# Altium schematic sheet Sheet_MCU_BOOT.SchDoc
size A4; SheetNumber: 3; SheetTotal: 5
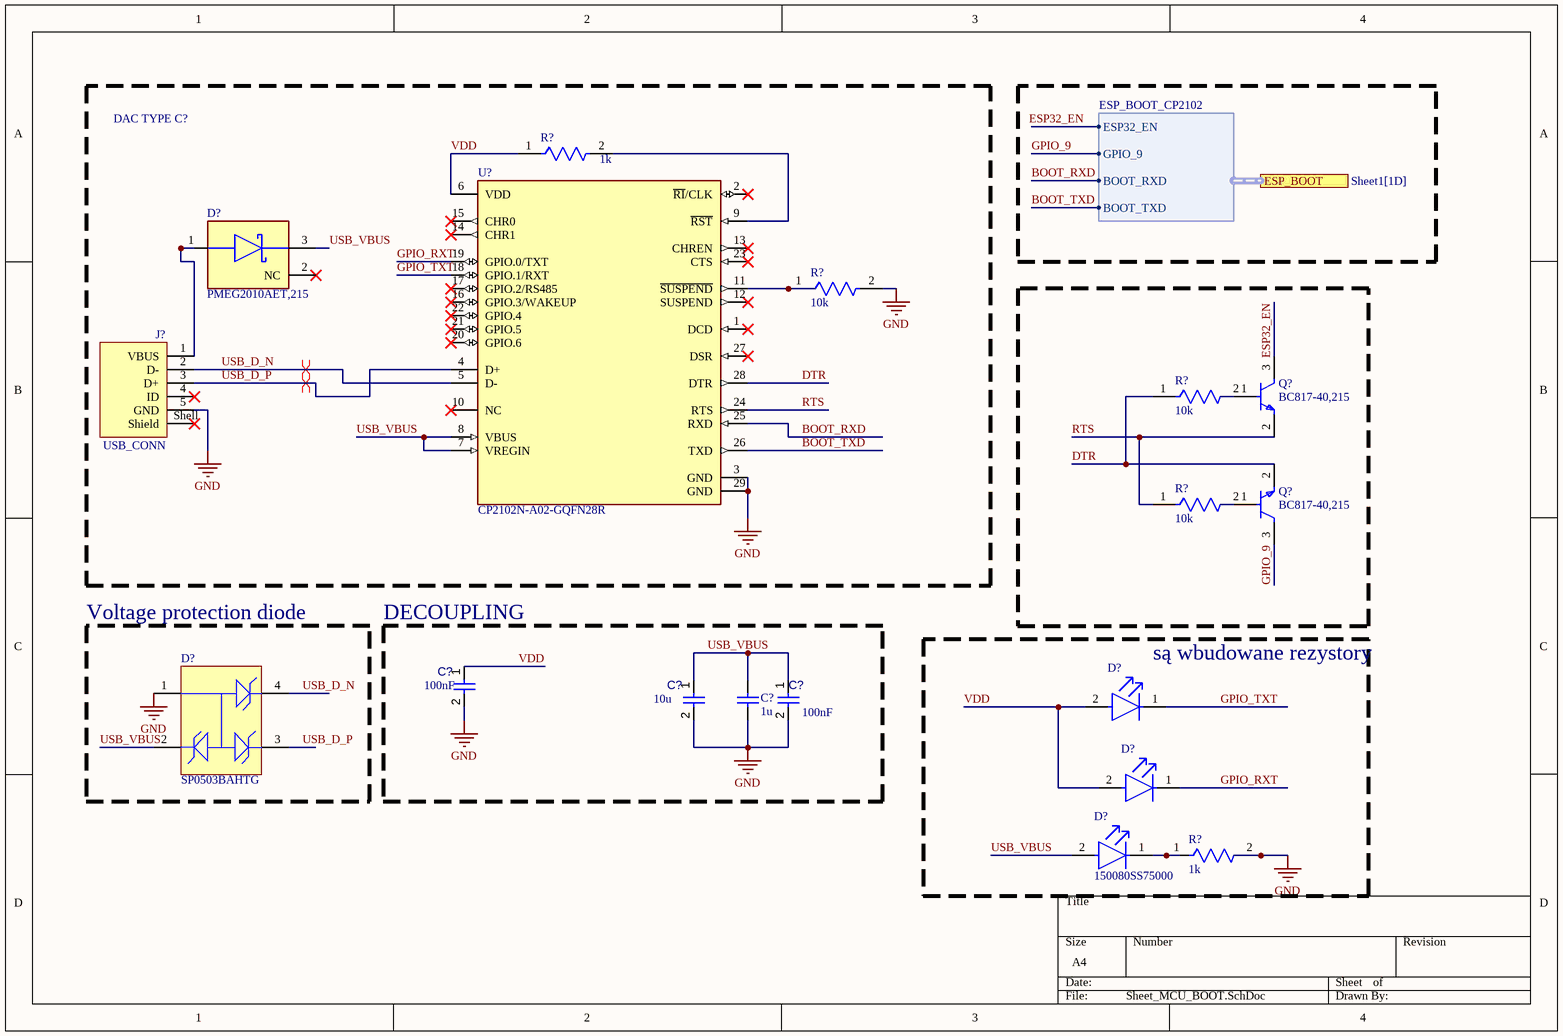
[diagram p0: Sheet_MCU_BOOT.SchDoc]

## Parts
(Parts that share a designator on the sheet are numbered #1, #2 ... from top to bottom, then left to right.)
C?#1  value 100nF  [CAPC2013X95X50LL10T25]  (hidden comment: Capacitor 100 nF +/-10% 50 V 0805)
C?#2  value 10u  [CAPC2013X95X50LL10T25]  (hidden comment: Capacitor 100 nF +/-10% 50 V 0805)
C?#3  value 100nF  [CAPC2013X95X50LL10T25]  (hidden comment: Capacitor 100 nF +/-10% 50 V 0805)
C?#4  1u  [CAPC2013X140X50LL20T25]
D?#1  PMEG2010AET,215  [FP-SOT23-MFG]
D?#2  SP0503BAHTG  [LFUS-SOT143-4_V]
D?#3  LTST-C170GKT  [FP-LTST-C170GKT-MFG]  (value not drawn)
D?#4  APHCM2012SYCK-F01  [FP-APHCM2012SYCK-F01-MFG]  (value not drawn)
D?#5  150080SS75000  [FP-150080SS75000-MFG]
J?  USB_CONN  [651305142821]
Q?#1  BC817-40,215  [FP-SOT23-MFG]
Q?#2  BC817-40,215  [FP-SOT23-MFG]
R?#1  1k  [FP-AF0805-IPC_A]
R?#2  10k  [FP-RN732A-MFG]
R?#3  10k  [FP-RN732A-MFG]
R?#4  10k  [FP-RN732A-MFG]
R?#5  1k  [FP-RN732A-MFG]
U?  CP2102N-A02-GQFN28R  [FP-CP2102N-A02-GQFN28R-IPC_A]

## Blocks framed on the sheet
Voltage protection diode: D?#2
DECOUPLING: C?#1-C?#4
są wbudowane rezystory: D?#3-D?#5 R?#5

## Ports
ESP_BOOT (harness ESP_BOOT_CP2102, see Sheet1[1D])

## Harnesses
ESP_BOOT_CP2102: ESP32_EN, GPIO_9, BOOT_RXD, BOOT_TXD

## Nets
GND: C?#1.2 C?#2.2 C?#3.2 C?#4.1 D?#2.1 J?.5(GND) R?#2.2 R?#5.2 U?.3(GND) U?.29(GND)
BOOT_RXD: U?.25(RXD) ; port ESP_BOOT.BOOT_RXD
BOOT_TXD: U?.26(TXD) ; port ESP_BOOT.BOOT_TXD
DTR: Q?#2.2(E) R?#3.1 U?.28(DTR)
ESP32_EN: Q?#1.3(C) ; port ESP_BOOT.ESP32_EN
GPIO_9: Q?#2.3(C) ; port ESP_BOOT.GPIO_9
GPIO_RXT: D?#4.1(C) U?.19(GPIO.0/TXT)
GPIO_TXT: D?#3.1(C) U?.18(GPIO.1/RXT)
RTS: Q?#1.2(E) R?#4.1 U?.24(RTS)
USB_D_N: D?#2.4 J?.2(D-) U?.5(D-)
USB_D_P: D?#2.3 J?.3(D+) U?.4(D+)
USB_VBUS: C?#2.1 C?#3.1 C?#4.2 D?#1.3(C) D?#2.2 D?#5.2(A) U?.7(VREGIN) U?.8(VBUS)
VDD: C?#1.1 D?#3.2(A) D?#4.2(A) R?#1.1 U?.6(VDD)
NetD?#1_1: D?#1.1(A) J?.1(VBUS)
NetD?#5_1: D?#5.1(C) R?#5.1
NetR?#1_2: R?#1.2 U?.9(~{RST})
NetR?#2_1: R?#2.1 U?.11(~{SUSPEND})

Not connected (* = marked no-connect by the designer): D?#1 2(NC)*; J? 4(ID)* Shell(Shield)*; Q?#1 1(B); Q?#2 1(B); R?#3 2; R?#4 2; U? 1(DCD)* 2(~{RI}/CLK)* 10(NC)* 12(SUSPEND)* 13(CHREN)* 14(CHR1)* 15(CHR0)* 16(GPIO.3/WAKEUP)* 17(GPIO.2/RS485)* 20(GPIO.6)* 21(GPIO.5)* 22(GPIO.4)* 23(CTS)* 27(DSR)*

## Layout directives
differential pair: USB_D_N, USB_D_P

## Notes on the sheet
- DAC TYPE C?
- (near D?#1) ??

## Library data of the parts
C?#1-C?#3 = CMP-001-00018-6: Chip Capacitor, 100 nF, +/- 10%, 50 V, 0805 (2012 Metric); Capacitor Type: Ceramic; Voltage Rating: 50V; Pins: 2; Max Operating Temperature: 125°C; Min Operating Temperature: -55°C; Mounting Technology: SM; Case/Package: 0805; RoHS Compliant: True; Tolerance: 10%
C?#4 = CMP-1036-04749-2: Manufacturer: Kemet; Part Number: C0805C105M4RACTU
D?#1 = CMP-14398-000002-1: DIODE SCHOTTKY 20V 1A SOT23; Manufacturer: Nexperia; Description: Diode Schottky 20V 1A Automotive 3-Pin TO-236AB T/R; Max Surge Forward Current: 9A; Automotive Grade: Grade 0; Max Junction Temp: +150°C; Value: 55pF; Peak Reverse Current: 50uA; Reverse Voltage: 20V; Device Class L1: Discrete Semiconductors; Package: SOT23; RoHS: TRUE; Manufacturer Part Number: PMEG2010AET,215; Digikey Description: DIODE SCHOTTKY 20V 1A SOT23; Forward Current: 1A; ComponentLink2URL: https://assets.nexperia.com/documents/data-sheet/PMEG2010AEH_PMEG2010AET.pdf; Lead Free: Yes; Temperature: to +150°C; Category: Diode; Octopart: https://octopart.com/pmeg2010aet%2C215-nexperia-78741406; Ambient Temperature Range Low: -65°C; Height: 1.1mm; ComponentLink2Description: Datasheet; Device Class L2: Diodes; Device Class L3: Schottky Diodes; Capacitance: 55pF; Footprint Url: https://assets.nexperia.com/documents/outline-drawing/SOT23.pdf; Ambient Temperature Range High: +150°C; Automotive: Yes; Temperature Range High: +150°C
D?#2 = CMP-2000-05191-1: TVS Diode Array, 30 pF, 30 KV, -40 to 85 degC, 4-Pin SOT143, RoHS, Tape and Reel; Manufacturer: Littelfuse; Direction Type: Uni-Directional; Product Height (mm): 1.05mm; Leakage Current (Max): 0.1uA; Clamping Voltage (Max): 8V; Reverse Stand-off Voltage: 5.5(Min)V; Configuration: Triple; Working Voltage: 5.5V; Product Length (mm): 3.04mm; Working Voltage (Max): 5.5V(Min); Capacitance Value: 30pF; Rad Hardened: No; Number of Elements: 3; Product Depth (mm): 1.4mm; Operating Temperature Max Deg. C: 85C; Suppressor Type: TVS; Operating Temperature Min Deg. C: -40C; Operating Temp Range: -40Cto85C; Mounting: SurfaceMount; Package / Case: SOT-143; Datasheet Version: Dec-13; Package Type: SOT-143; Packaging: TapeandReel; Pin Count: 3+Tab; Operating Temperature Classification: Industrial; Datasheet URL: https://datasheet.ciiva.com/15143/getdatasheetpartid-116020-15143550.pdf; Manufacturer URL: http://www.littelfuse.com/; Leakage Current: 0.1uA; Mounting Style: SurfaceMount; Clamping Voltage: 8V; Polarity: Uni-Directional
D?#3 = CMP-1674-00002-6: LED GREEN CLEAR SMD; Dominant Wavelength: 569nm; Lens Style: Diffused; Forward Voltage: 2.1V; Number of Elements: 1; Wavelength: 565nm; Luminous Intensity: 6mcd; Test Current: 10mA; Power Dissipation: 100mW; Reverse Voltage: 5V; Forward Current: 30mA; Viewing Angle: 130°; Lens Color: Colorless; Min Operating Temperature: -55°C; Number of Pins: 2; Max Operating Temperature: 85°C; Color: Green; Radiation Hardening: No; Illumination Color: Green; Case Code (Metric): 2012; Lens Transparency: Clear; Case/Package: 0805; Width: 1.25mm; Case Code (Imperial): 0805; Package Quantity: 1; Height: 1.1mm; Depth: 1.25mm; Length: 2mm; Power Rating: 100mW; Lead Free: Lead Free; Number of LEDs: 1; Packaging: Tape and Reel; Mount: Surface Mount; Voltage: 5V
D?#4 = CMP-44529-000064-1: LED YELLOW CLEAR CHIP SMD; Number of LEDs: 1; Luminous Intensity: 150mcd; Dominant Wavelength: 590nm; Test Current: 20mA; Illumination Color: Green; Forward Voltage: 2V; Viewing Angle: 110°; Number of Pins: 2; Packaging: Tape and Reel; Width: 1.25mm; Height: 0.4mm; Lens Color: Clear; RoHS Compliant: Yes; Lead Free: Lead Free; Min Operating Temperature: -40°C; Case Code (Imperial): 0805; Case/Package: 0805; Series: APHCM; Wavelength: 590nm; Max Operating Temperature: 85°C; Length: 2mm; Color: Yellow; Package Quantity: 2000; Mount: Surface Mount; Lens Style: Clear; Forward Current: 20mA; Case Code (Metric): 2012
D?#5 = CMP-004-00035-1: Red 630nm LED Indication - Discrete 1.9V 0805 (2012 Metric)
J? = CMP-1502-03247-3: Wr-com; Right Angle SMT Version 2.0; Ni Usb Connector Receptacle, 30 V AC, 1A; Operating Supply Voltage: 30V; Number of Contacts: 5; Insulation Resistance: 1GΩ; USB Standard: USB 2.0; Contact Resistance: 20mΩ; Min Operating Temperature: -40°C; Current Rating: 1A; Number of Pins: 5; Orientation: Horizontal; Gender: Receptacle; REACH SVHC: Unknown; Features: Shielded; Packaging: Tape and Reel; Max Operating Temperature: 105°C; RoHS: Compliant; Contact Material: Copper; Contact Plating: Gold; Connector Type: USB; Lead Free: Lead Free; Mount: Horizontal, Surface Mount; Termination: SMD/SMT
Q?#1 Q?#2 = CMP-14406-000007-1: TRANS NPN 45V 0.5A SOT23; Manufacturer: Nexperia; Collector Emitter Saturation Voltage: 700mV; Power Dissipation: 250mW; Collector Base Voltage: 50V; Unity Gain Freq: 100MHz; Hfe Max: 600; Rthja Max: 500K/W; Emitter Base Voltage: 5V; Max Collector Current: 500mA; Hfe Testvce: 1V; Automotive Grade: Grade 0; Hfe Min: 250; Max Junction Temp: +150°C; Number Of Npn: 1; Hfe Testic: 100mA; Octopart: https://octopart.com/bc817-40%2C215-nexperia-78739081; Lead Free: Yes; Ipc Land Pattern Name: SOT95P230X100-3; Manufacturer Part Number: BC817-40,215; RoHS: TRUE; Collector Emitter Breakdown Voltage: 45V; Digikey Description: TRANS NPN 45V 0.5A SOT23; ComponentLink2URL: https://assets.nexperia.com/documents/data-sheet/BC817_SER.pdf; Temperature Range High: +150°C; Mouser Description: BC817 Series 45 V 500 mA 250 mW SMT NPN General-Purpose Transistor - SOT-23-; Device Class L3: BJTs; Temperature: to +150°C; Height: 1.1mm; Automotive: Yes; Ambient Temperature Range Low: -65°C; Package: SOT23; Collector Emitter Voltage: 45V; Category: Trans; ComponentLink2Description: Datasheet; Device Class L2: Transistors; Ambient Temperature Range High: +150°C; Number Of Elements: 1; Device Class L1: Discrete Semiconductors; Footprint Url: https://assets.nexperia.com/documents/outline-drawing/SOT23.pdf
R?#1 = CMP-03412-043866-1: Anti-Sulfurated Chip Resistor Automotive Grade 1kΩ 1% 0.125W ±100ppm/°C 0805; Max Power Dissipation: 125mW; Resistance: 1kR; Number of Terminations: 2; Series: AF; Length: 0.079inch; Min Operating Temperature: -55°C; Packaging: Tape and Reel; Features: Moisture Resistant; Tolerance: 1%; Resistor Type: Thick Film; RoHS Compliant: Yes; Case/Package: 0805; Height: 0.024inch; Max Operating Temperature: 155°C; Temperature Coefficient: 100ppm/°C; Width: 0.049inch
R?#2-R?#5 = CMP-03211-001183-1: SMD Chip Resistor, Thin Film, 22.1KΩ, 100 V, 0805 [2012 Metric], 100 mW, 0.1%, RN73 Series; Manufacturer Part Number: RN73C2A22K1BTDF; Manufacturer: TE Connectivity; Power Rating: 0.1W; Temperature Coefficient: 10ppm/°C; Voltage Rating: 100V; Package: RN732A; Lead Free: Yes; ComponentLink2URL: https://www.te.com/commerce/DocumentDelivery/DDEController?Action=showdoc&DocId=Data+Sheet%7F1773270%7FP%7Fpdf%7FEnglish%7FENG_DS_1773270_P.pdf%7F1676162-2; Temperature Range High: 155°C; Series: RN73; packaging: 1000 Reel; RoHS: TRUE; Automotive: No; Composition: Thin Film; Resistance: 22.1KΩ; Ipc Land Pattern Name: RESC200125X55; Category: Res; octopart_url: https://octopart.com/rn73c2a22k1btdf-te+connectivity-41129296; Device Class L2: Resistors; Device Class L3: Chip SMD Resistors; Value: 22.1KΩ; Device Class L1: Passive Components; Height: 0.65mm; Temperature Range Low: -55°C; ComponentLink2Description: Datasheet; Octopart: https://octopart.com/rn73c2a22k1btdf-te+connectivity-41129296; Tolerance: 0.1%; Temperature: -55°C to 155°C
U? = CMP-015-00009-2: USB Bus Controller, CMOS